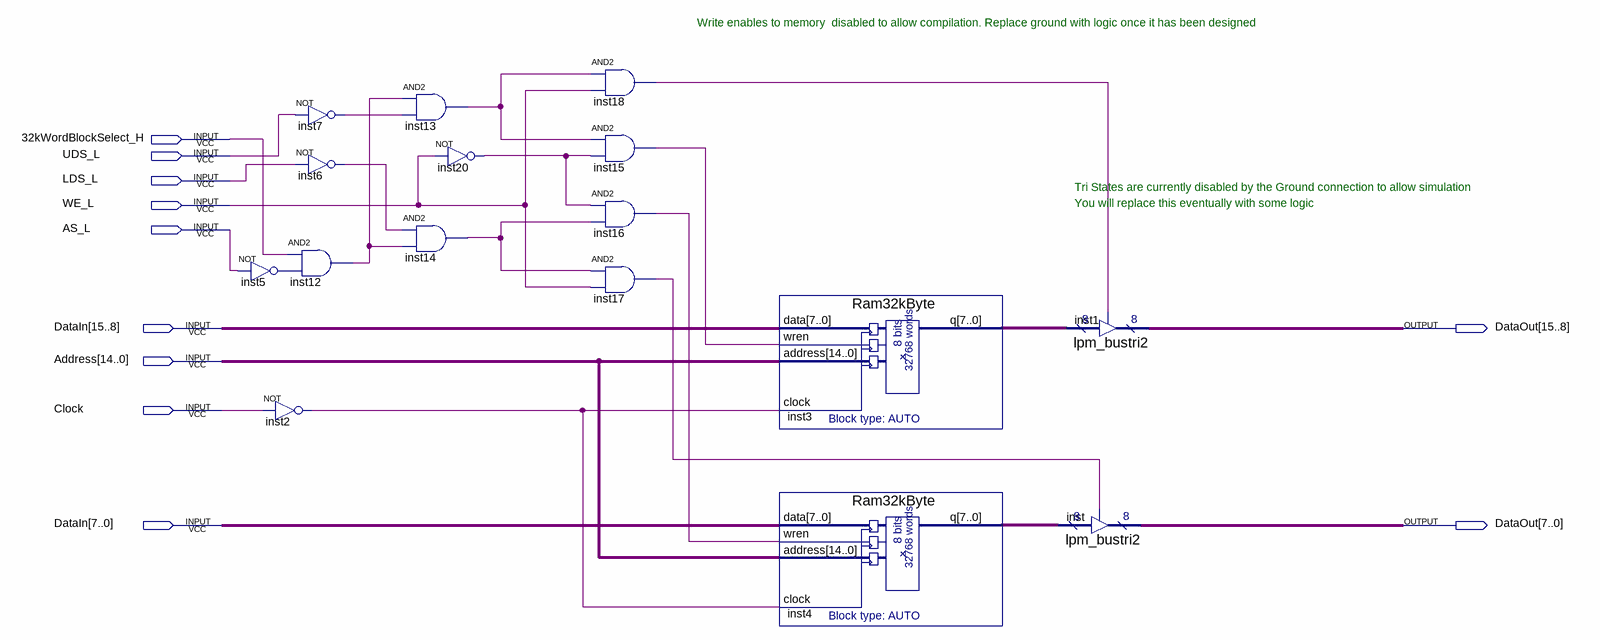
[diagram p0: schematic sheet]
// Quartus schematic SramBlock_32KWord.bdf as structural Verilog: 16 symbols, 11 pins
module SramBlock_32KWord (
  input  \32kWordBlockSelect_H ,
  input  UDS_L,
  input  LDS_L,
  input  WE_L,
  input  AS_L,
  input  [15:0] DataIn,
  input  [14:0] Address,
  input  Clock,
  output [15:0] DataOut
);

  wire inst2_out, inst5_out, inst6_out, inst7_out, inst12_out, inst13_out, inst14_out, inst15_out,
       inst16_out, inst17_out, inst18_out, inst20_out;
  wire [7:0] inst3_q, inst4_q;

  not inst5 (inst5_out, AS_L);
  not inst2 (inst2_out, Clock);
  not inst7 (inst7_out, UDS_L);
  not inst6 (inst6_out, LDS_L);
  and inst12 (inst12_out, \32kWordBlockSelect_H , inst5_out);
  and inst13 (inst13_out, inst12_out, inst7_out);
  and inst14 (inst14_out, inst6_out, inst12_out);
  not inst20 (inst20_out, WE_L);
  and inst18 (inst18_out, inst13_out, WE_L);
  and inst15 (inst15_out, inst13_out, inst20_out);
  and inst16 (inst16_out, inst20_out, inst14_out);
  and inst17 (inst17_out, inst14_out, WE_L);
  Ram32kByte inst3 (.data(DataIn[15:8]), .wren(inst15_out), .address(Address), .clock(inst2_out), .q(inst3_q));
  Ram32kByte inst4 (.data(DataIn[7:0]), .wren(inst16_out), .address(Address), .clock(inst2_out), .q(inst4_q));
  lpm_bustri2 inst1 (.enabledt(inst18_out), .data(inst3_q), .tridata(DataOut[15:8]));
  lpm_bustri2 inst (.enabledt(inst17_out), .data(inst4_q), .tridata(DataOut[7:0]));

  // Notes on the sheet:
  //   Write enables to memory  disabled to allow compilation. Replace ground with logic once it has been designed
  //   Tri States are currently disabled by the Ground connection to allow simulation
  //   You will replace this eventually with some logic
endmodule
